# EAGLE schematic ACEnewSensors (EAGLE 9.6.2)

## Sheet 1 of 3
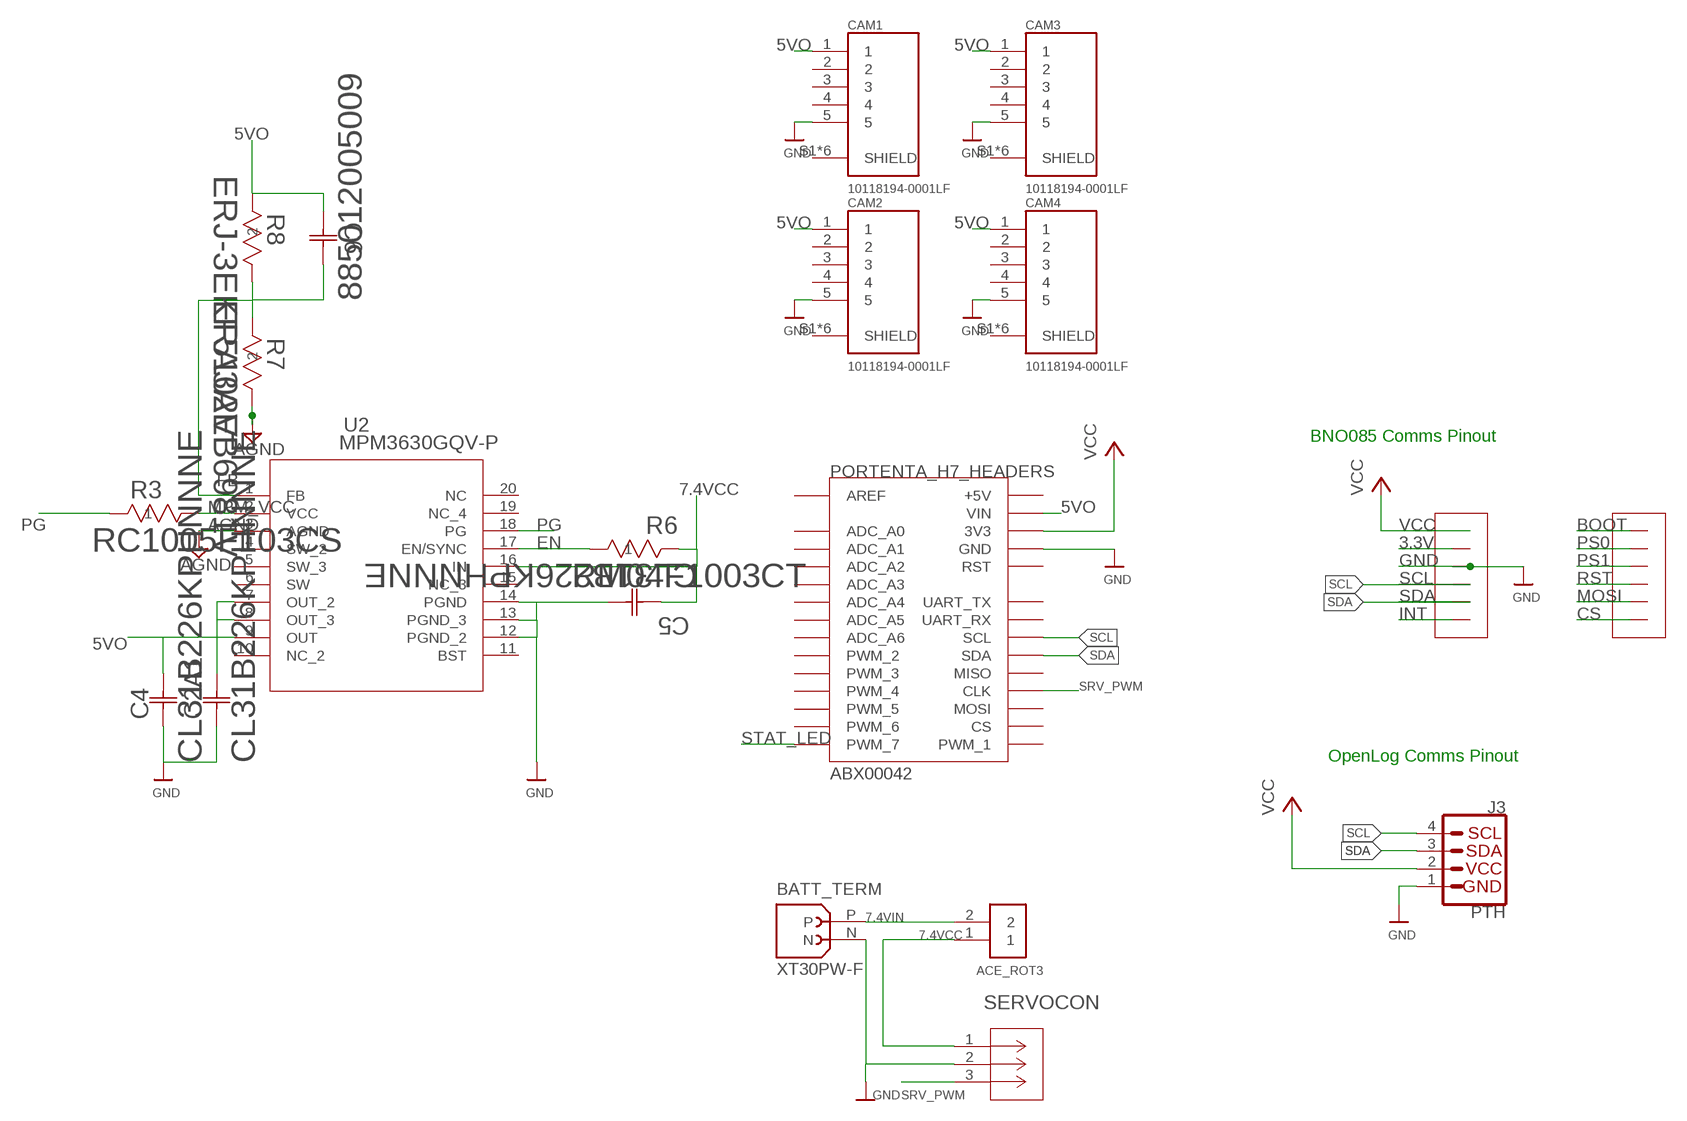
[diagram p0: schematic, sheet 1]

### Parts
ACE_ROT3  282837-2  [TE_282837-2]
BATT_TERM  XT30PW-F  [AMASS_XT30PW-F]
C2A1  CL31B226KPHNNNE  [CAP_CL31_SAM]
C4  CL31B226KPHNNNE  [CAP_CL31_SAM]
C5  CL31B226KPHNNNE  [CAP_CL31_SAM]
C6  885012005009  [CAP_885012005_WRE]
CAM1  10118194-0001LF  [AMPHENOL_10118194-0001LF]
CAM2  10118194-0001LF  [AMPHENOL_10118194-0001LF]
CAM3  10118194-0001LF  [AMPHENOL_10118194-0001LF]
CAM4  10118194-0001LF  [AMPHENOL_10118194-0001LF]
J3  PTH  I2C_STANDARD_NO_SILK  [1X04_NO_SILK]
R3  RC1005F103CS  [RES_1005_SAM]
R6  RM04F1003CT  [RES_RM04_CCE]
R7  ERA3AEB6981V  [RES_ERA3A_0603_PAN]
R8  ERJ-3EKF5102V  [RC0603N_PAN]
SERVOCON  B03B-PASK-1_(LF)_(SN)  [CONN_B03B-PASK-1_(LF)_(SN)_JST]
U2  MPM3630GQV-P  [QFN3P0X5P0X1P6_MPM3630_MNP]
U$5  ADAFRUIT_BNO08X  [ADAFRUIT_BNO08X_FOOTPRINT]
U$10  ABX00042_HEADERS_IO  [MODULE_ABX00042_HEADERS]

### Nets
5VO: C2A1.2 C4.2 C6.2 CAM1.1 CAM2.1 CAM3.1 CAM4.1 R8.2 U2.7(OUT_2) U2.8(OUT_3) U2.9(OUT) U$10.J16(VIN)
7.4VCC: ACE_ROT3.1 C5.1 R6.2 SERVOCON.1 U2.16(IN)
7.4VIN: ACE_ROT3.2 BATT_TERM.P
AGND: R7.1 U2.3(AGND)
EN: R6.1 U2.17(EN/SYNC)
FB: C6.1 R7.2 R8.1 U2.1(FB)
GND [lowpower]: BATT_TERM.N C2A1.1 C4.1 C5.2 CAM1.5 CAM2.5 CAM3.5 CAM4.5 J3.1(GND) SERVOCON.2 U2.12(PGND_2) U2.13(PGND_3) U2.14(PGND) U$5.GND U$10.J18(GND) ; also sheet 2,3
MPM_VCC: R3.2 U2.2(VCC)
PG: R3.1 U2.18(PG)
SCL: J3.4(SCL) U$5.SCL U$10.J22(SCL) ; also sheet 2,3
SDA: J3.3(SDA) U$5.SDA U$10.J23(SDA) ; also sheet 2,3
SRV_PWM: SERVOCON.3 U$10.J25(CLK)
STAT_LED: U$10.J9(PWM_7)
VCC [lowpower]: J3.2(VCC) U$5.VIN(VCC) U$10.J17(3V3) ; also sheet 2,3
Unconnected: CAM1.2 CAM1.3 CAM1.4 CAM1.S1(SHIELD) CAM1.S2(SHIELD) CAM1.S3(SHIELD) CAM1.S4(SHIELD) CAM1.S5(SHIELD) CAM1.S6(SHIELD) CAM2.2 CAM2.3 CAM2.4 CAM2.S1(SHIELD) CAM2.S2(SHIELD) CAM2.S3(SHIELD) CAM2.S4(SHIELD) CAM2.S5(SHIELD) CAM2.S6(SHIELD) CAM3.2 CAM3.3 CAM3.4 CAM3.S1(SHIELD) CAM3.S2(SHIELD) CAM3.S3(SHIELD) CAM3.S4(SHIELD) CAM3.S5(SHIELD) CAM3.S6(SHIELD) CAM4.2 CAM4.3 CAM4.4 CAM4.S1(SHIELD) CAM4.S2(SHIELD) CAM4.S3(SHIELD) CAM4.S4(SHIELD) CAM4.S5(SHIELD) CAM4.S6(SHIELD) U2.4(SW_2) U2.5(SW_3) U2.6(SW) U2.10(NC_2) U2.11(BST) U2.15(NC_3) U2.19(NC_4) U2.20(NC) U$5.3VO(3.3V) U$5.BT(BOOT) U$5.CS U$5.DI(MOSI) U$5.INT U$5.P0(PS0) U$5.P1(PS1) U$5.RST U$10.J1(AREF) U$10.J2(ADC_A0) U$10.J3(ADC_A1) U$10.J4(ADC_A2) U$10.J5(ADC_A3) U$10.J6(ADC_A4) U$10.J7(ADC_A5) U$10.J8(ADC_A6) U$10.J10(PWM_6) U$10.J11(PWM_5) U$10.J12(PWM_4) U$10.J13(PWM_3) U$10.J14(PWM_2) U$10.J15(+5V) U$10.J19(RST) U$10.J20(UART_TX) U$10.J21(UART_RX) U$10.J24(MISO) U$10.J26(MOSI) U$10.J27(CS) U$10.J28(PWM_1)

### Notes on the sheet
- BNO085 Comms Pinout
- OpenLog Comms Pinout

## Sheet 2 of 3
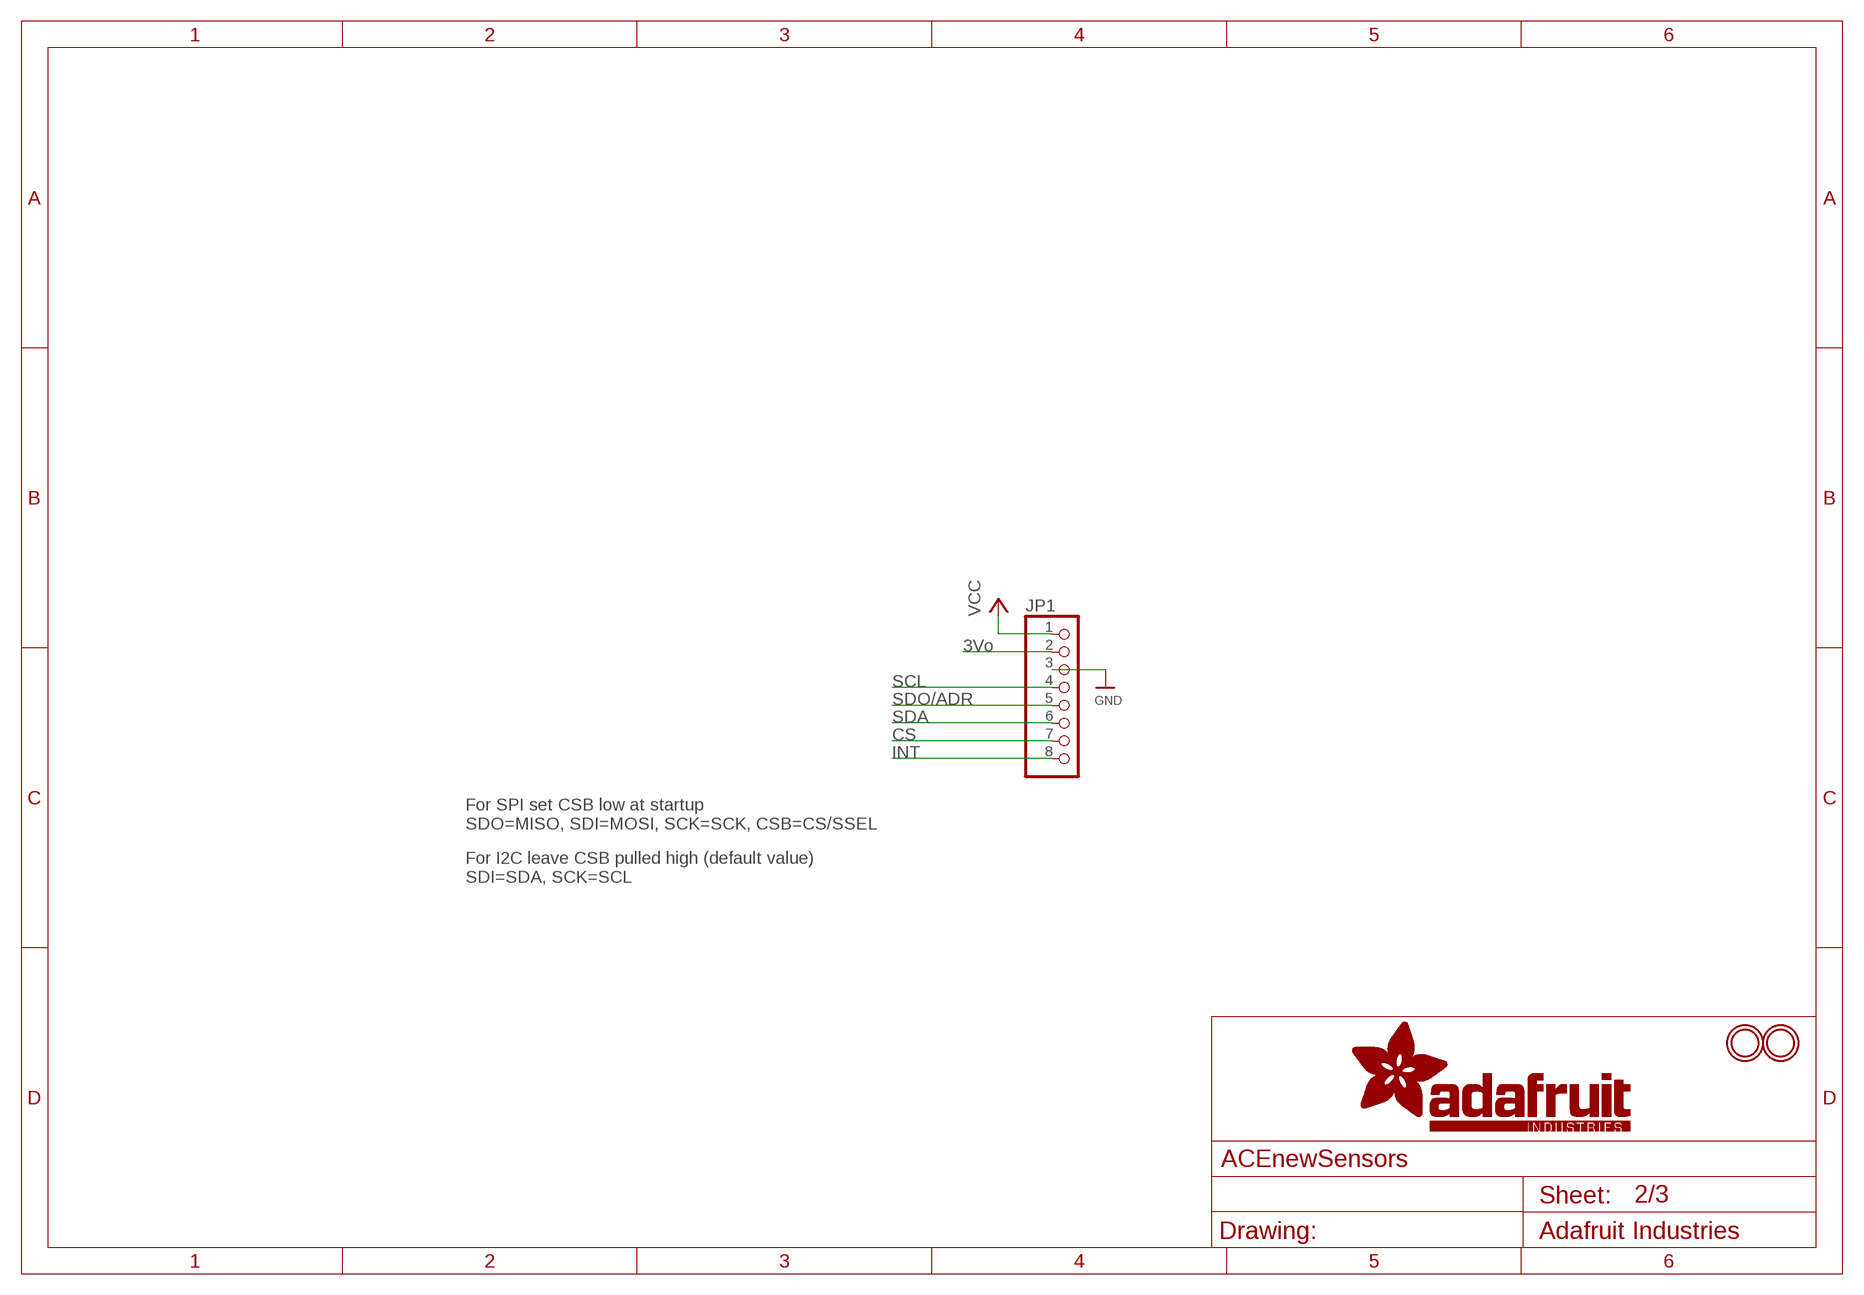
[diagram p1: schematic, sheet 2]

### Parts
JP1  HEADER-1X870MIL  [1X08_ROUND_70]
U$1  MOUNTINGHOLE2.0  [MOUNTINGHOLE_2.0_PLATED]
U$3  MOUNTINGHOLE2.0  [MOUNTINGHOLE_2.0_PLATED]

### Nets
CS: JP1.7
GND [lowpower]: JP1.3 ; also sheet 1,3
INT: JP1.8
N$2 [lowpower]: JP1.2
SCL: JP1.4 ; also sheet 1,3
SDA: JP1.6 ; also sheet 1,3
SDO/ADR: JP1.5
VCC [lowpower]: JP1.1 ; also sheet 1,3

### Notes on the sheet
- 3Vo
- For SPI set CSB low at startup
  SDO=MISO, SDI=MOSI, SCK=SCK, CSB=CS/SSEL
- For I2C leave CSB pulled high (default value)
  SDI=SDA, SCK=SCL

## Sheet 3 of 3
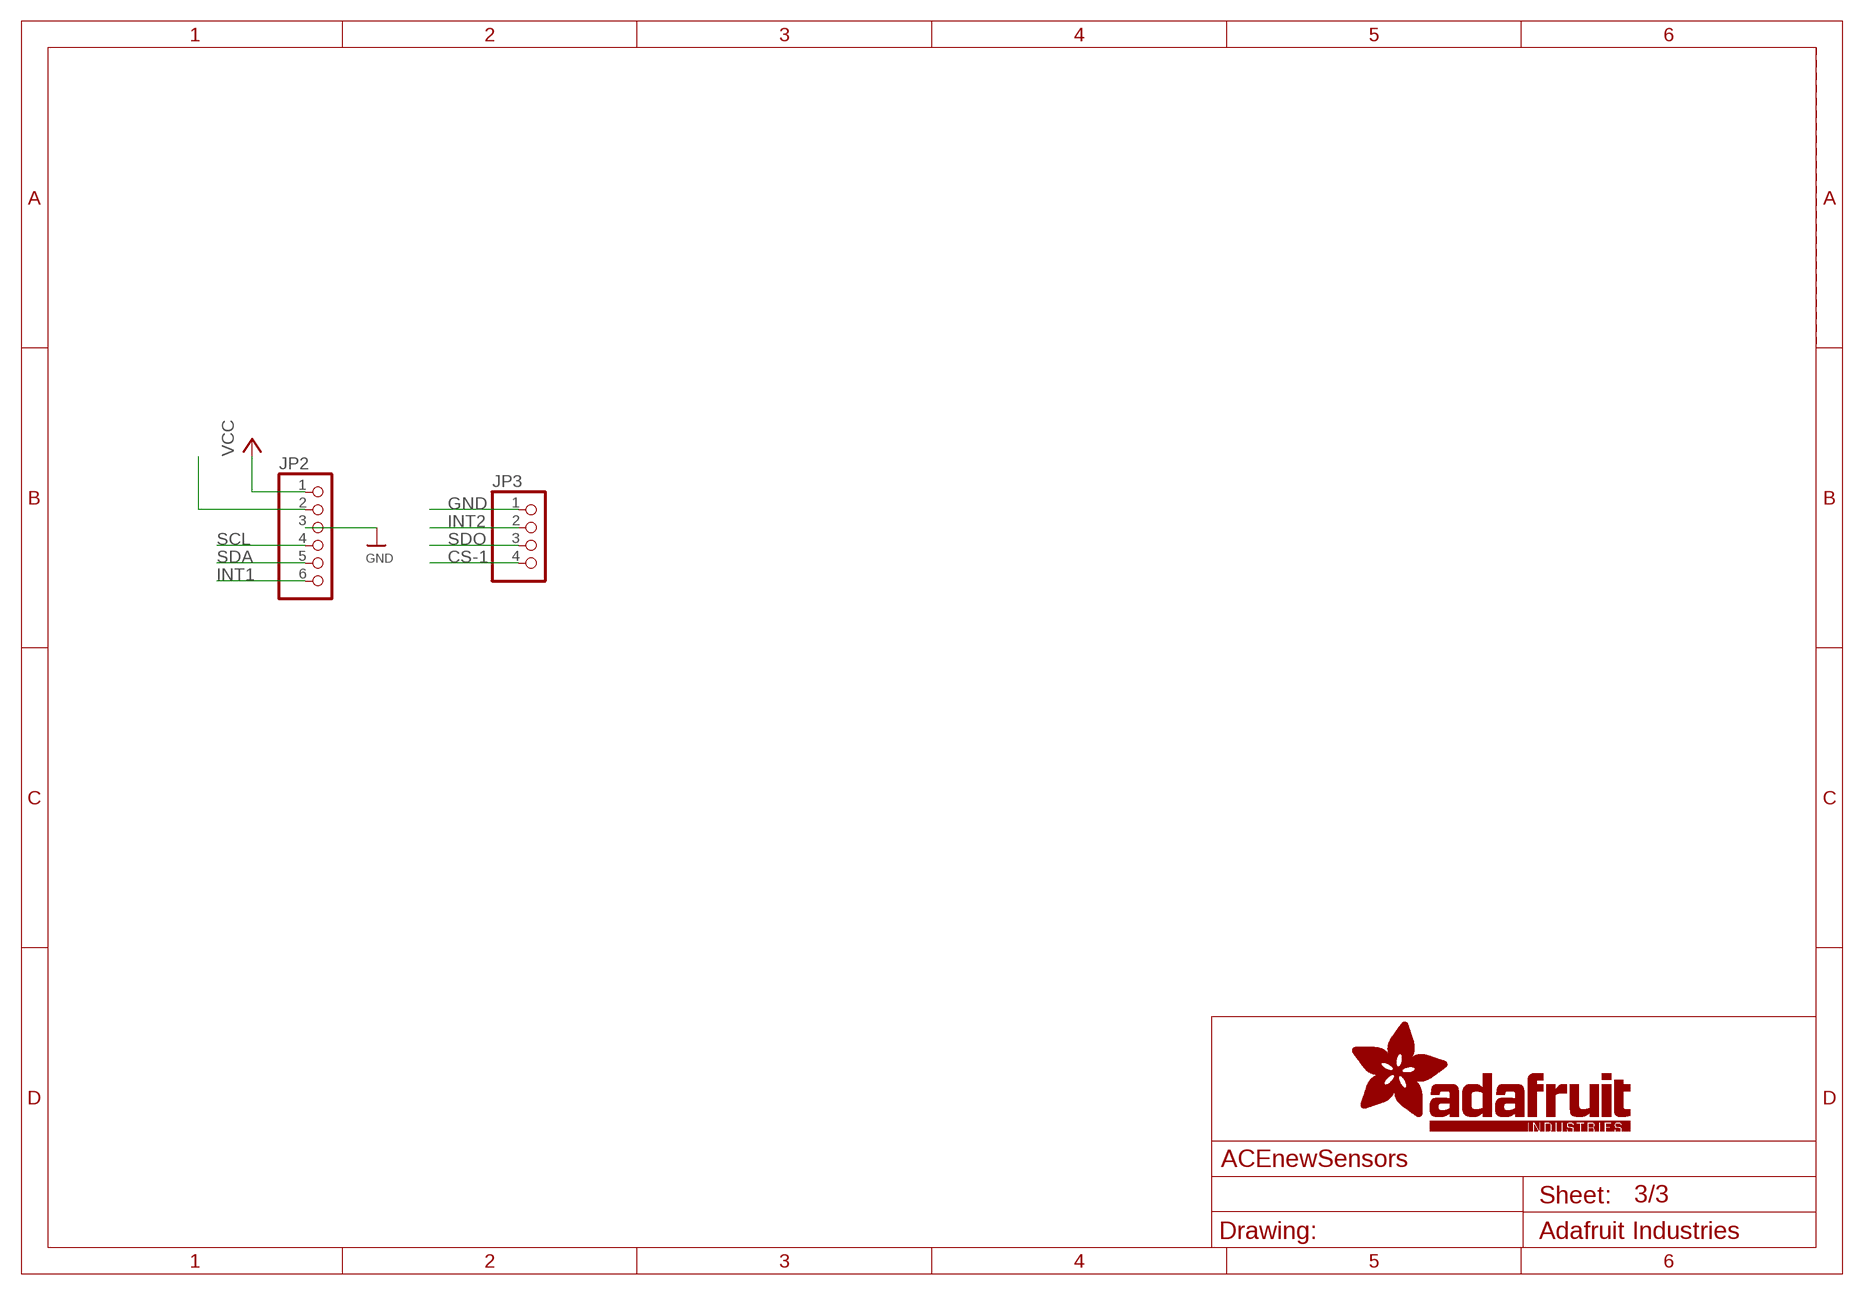
[diagram p2: schematic, sheet 3]

### Parts
JP2  HEADER-1X670MIL  [1X06_ROUND_70]
JP3  HEADER-1X4ROUND  [1X04_ROUND]

### Nets
CS-1: JP3.4
GND [lowpower]: JP2.3 JP3.1 ; also sheet 1,2
INT1: JP2.6
INT2: JP3.2
N$1 [lowpower]: JP2.2
SCL: JP2.4 ; also sheet 1,2
SDA: JP2.5 ; also sheet 1,2
SDO: JP3.3
VCC [lowpower]: JP2.1 ; also sheet 1,2

## Library data of the parts
ACE_ROT3 = 282837-2:282837-2: TERM BLOCK 5.08MM 2POS SIDE ENTY Check availability <https://pricing.snapeda.com/parts/282837-2/TE%20Connectivity/view-part?ref=eda>; AVAILABILITY: In Stock; CHECK_PRICES: https://www.snapeda.com/parts/282837-2/TE+Connectivity+AMP+Connectors/view-part/?ref=eda; COMMENT: 282837-2; DESCRIPTION: Terminal Block Connector Wire Receptacle 2 5.08 mm 30-16 AWG Green 13.5 A 250 V | TE Connectivity 282837-2; MF: TE Connectivity; MP: 282837-2; PACKAGE: None; PRICE: None; PURCHASE-URL: https://www.snapeda.com/api/url_track_click_mouser/?unipart_id=2549980&manufacturer=TE Connectivity&part_name=282837-2&search_term=None; SNAPEDA_LINK: https://www.snapeda.com/parts/282837-2/TE+Connectivity+AMP+Connectors/view-part/?ref=snap
BATT_TERM = XT30PW-F:XT30PW-F: Check availability <https://pricing.snapeda.com/parts/XT30PW-F/amass/view-part?ref=eda>; AVAILABILITY: Not in stock; CHECK_PRICES: https://www.snapeda.com/parts/XT30PW-F/AMASS/view-part/?ref=eda; DESCRIPTION: Socket; DC supply; XT30; female; PIN: 2; on PCBs; THT; yellow; 15A; MF: amass; MP: XT30PW-F; PACKAGE: None; PRICE: None; SNAPEDA_LINK: https://www.snapeda.com/parts/XT30PW-F/AMASS/view-part/?ref=snap
C2A1 C4 C5 = 22uF_Capacitor:CL31B226KPHNNNE; COPYRIGHT: Copyright (C) 2024 Ultra Librarian. All rights reserved.; MANUFACTURER_PART_NUMBER: CL31B226KPHNNNE; MFR_NAME: Samsung
C6 = 22pF_Capacitor:885012005009; COPYRIGHT: Copyright (C) 2024 Ultra Librarian. All rights reserved.; MANUFACTURER_PART_NUMBER: 885012005009; MFR_NAME: Wurth Electronics
CAM1-CAM4 = USB_Micro_B_v2:10118194-0001LF: Check availability <https://pricing.snapeda.com/parts/10118194-0001LF/Amphenol%20ICC/view-part?ref=eda>; AVAILABILITY: In Stock; CHECK_PRICES: https://www.snapeda.com/parts/10118194-0001LF/Amphenol+FCI/view-part/?ref=eda; DESCRIPTION: Micro USB, Input Output Connectors, B TYPE RECEPTACLE with flange; MF: Amphenol ICC; MP: 10118194-0001LF; PACKAGE: None; PRICE: None; PURCHASE-URL: https://www.snapeda.com/api/url_track_click_mouser/?unipart_id=47625&manufacturer=Amphenol ICC&part_name=10118194-0001LF&search_term=None; SNAPEDA_LINK: https://www.snapeda.com/parts/10118194-0001LF/Amphenol+FCI/view-part/?ref=snap
J3 = SparkX:I2C_STANDARD: SparkFun I2C Standard Pinout Header SparkFun has standardized on a pinout for all I2C based sensor breakouts. This pinout allows I2C boards to be plugged directly into the headers on Arduino Uno compatible boards, and to be daisy chained easily. Example SparkFun Products: SparkFun Atmospheric Sensor Breakout - BME280 <https://www.sparkfun.com/products/13676> SparkFun Altitude/Pressure Sensor Breakout - MPL3115A2 <https://www.sparkfun.com/products/11084> SparkFun TOF Range Finder Sensor - VL6180 <https://www.sparkfun.com/products/12785>
JP1 = microbuilder:HEADER-1X8: PIN HEADER
JP2 = microbuilder:HEADER-1X6: PIN HEADER
JP3 = microbuilder:HEADER-1X4: PIN HEADER
R3 = 10kO_Resistor:RC1005F103CS; COPYRIGHT: Copyright (C) 2024 Ultra Librarian. All rights reserved.; MANUFACTURER_PART_NUMBER: RC1005F103CS; MFR_NAME: Samsung
R6 = 100kO_Resistor:RM04F1003CT; COPYRIGHT: Copyright (C) 2024 Ultra Librarian. All rights reserved.; MANUFACTURER_PART_NUMBER: RM04F1003CT; MFR_NAME: Cal-Chip Electronics
R7 = 6_98kO_Resistor:ERA3AEB6981V; COPYRIGHT: Copyright (C) 2024 Ultra Librarian. All rights reserved.; MANUFACTURER_PART_NUMBER: ERA3AEB6981V; MFR_NAME: Panasonic
R8 = 51kO_Resistor:ERJ-3EKF5102V; COPYRIGHT: Copyright (C) 2024 Ultra Librarian. All rights reserved.; MANUFACTURER_PART_NUMBER: ERJ-3EKF5102V; MFR_NAME: Panasonic
SERVOCON = 3_Pin_JST_XA_Surface_Connector:B03B-PASK-1_(LF)_(SN); COPYRIGHT: Copyright (C) 2024 Ultra Librarian. All rights reserved.; DIGIKEY_PART_NUMBER_1: 455-1833-ND; MANUFACTURER_PART_NUMBER: B03B-PASK-1 (LF) (SN); MFR_NAME: JST
U2 = MPM3630:MPM3630GQV-P; COPYRIGHT: Copyright (C) 2024 Ultra Librarian. All rights reserved.; MANUFACTURER_PART_NUMBER: MPM3630GQV-P; MFR_NAME: Monolithic Power Systems
U$1 U$3 = microbuilder:MOUNTINGHOLE: Mounting Hole For #2 screws (0.086"/2.18mm width, 0.094"/2.4mm hole) use 2.5mm; BOM: EXCLUDE
U$5 = ADAFRUIT_BNO08x:ADAFRUIT_BNO08X: Adafruit BNO08x Device
U$10 = ABX00042:ABX00042_HEADERS_IO: Device for Portenta H7 pin headers IO

## Net classes
1 highpower: width 0.305 mm, drill 0.483 mm
2 lowpower: width 0.254 mm, drill 0.483 mm